# Altium schematic sheet Copy of Power_Board.SchDoc: MAIN POWER 5V / 3V3 / 1V8
size A4; Date: Not used; ApprovedBy: Not used; CheckedBy: Not used; Author: Not used; CompanyName: STMicroelectronics; DrawnBy: Not used; Engineer: Not used; Organization: Not used; Address1: Not used; Address2: Not used; Address3: Not used; Address4: Not used; DocumentNumber: 9; Revision: Not used; SheetNumber: 8; SheetTotal: 9; CurrentTime: Not used; CurrentDate: Not used; Time: Not used; DocumentFullPathAndName: Not used; DocumentName: Not used; ModifiedDate: Not used; ImagePath: Not used; ProjectName: Not used; Application_BuildNumber: Not used
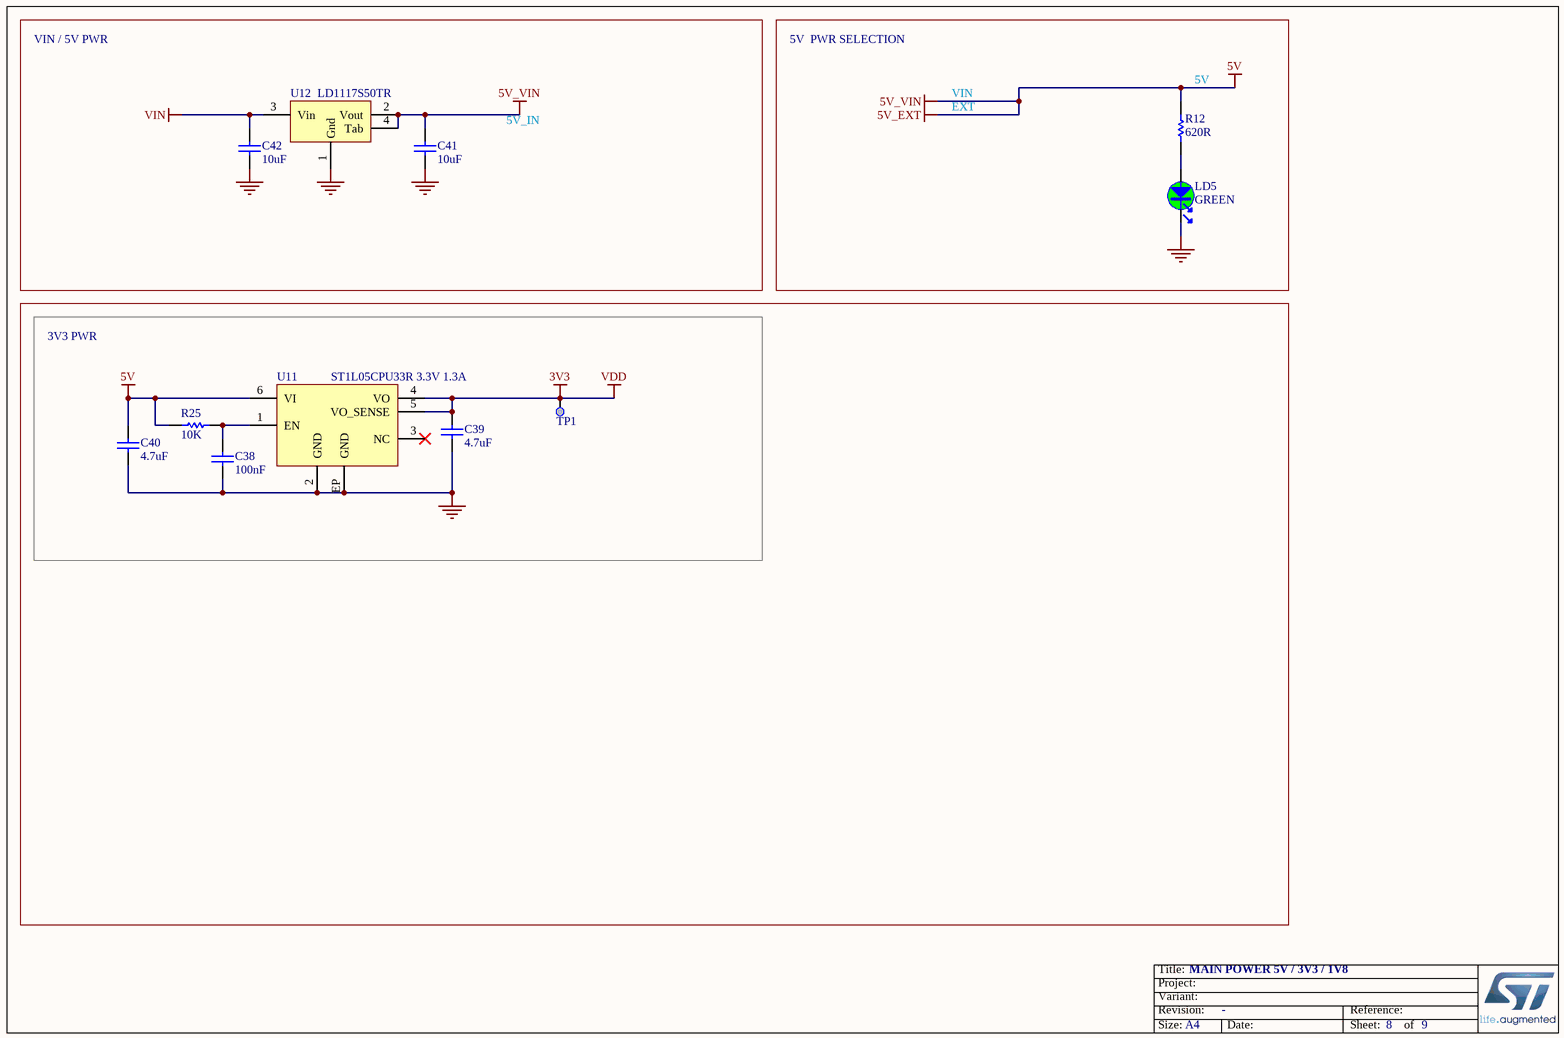
[diagram p0: Copy of Power_Board.SchDoc]

## Parts
C38  value 100nF  [C0402]  (hidden comment: Capacitor)
C39  value 4.7uF  [C0603]  (hidden comment: Capacitor)
C40  value 4.7uF  [C0603]  (hidden comment: Capacitor)
C41  value 10uF  [C0805]  (hidden comment: Capacitor)
C42  value 10uF  [C0805]  (hidden comment: Capacitor)
LD5  value GREEN  [LED_0603_OSRAM_LG-Q396-PS-35_GREEN_1A2K_H0P4]  (hidden comment: LED_green)
R12  value 620R  [R0603]  (hidden comment: Resistor)
R25  value 10K  [R0402]  (hidden comment: Resistor)
TP1  Test Point  [TP_SMD_1MM]  (value not drawn)  (no BOM)
U11  value ST1L05CPU33R 3.3V 1.3A  [ICC_DFN6-EPAD_3X3_P095]  (hidden comment: ST1L05CPU33R)
U12  LD1117S50TR  [REG_SOT223-TAB]

## Blocks framed on the sheet
3V3 PWR: C38-C40 R25 TP1 U11

## Nets
3V3: C39.2 TP1.1 U11.4(VO) U11.5(VO_SENSE)  [also labelled VDD]
5V: C40.2 C41.2 R12.2 R25.2 U11.6(VI) U12.2(Vout) U12.4(Tab)  [also labelled 5V_EXT, 5V_VIN]
GND: C38.2 C39.1 C40.1 C41.1 C42.1 LD5.2 U11.2(GND) U11.EP(GND) U12.1(Gnd)
VIN: C42.2 U12.3(Vin)
NetC38_1: C38.1 R25.1 U11.1(EN)
NetLD5_1: LD5.1 R12.1

Not connected (* = marked no-connect by the designer): U11 3(NC)*

## Notes on the sheet
- VIN / 5V PWR
- 5V  PWR SELECTION
- VIN
- EXT
- (near R12) 5V
- 5V_IN
- Title:
- Project:
- Size:
- Revision:
- Variant:
- A4
- -
- Date:
- Reference:
- Sheet:
- of

## Library data of the parts
C38 = MCD-00006: Capacitor, MLCC, 100nF, 16V, X7R, 10%, 0402, T=0.5mm; Manufacturer_Part_Number: CC0402KRX7R7BB104; Manufacturer: YAGEO; Alternate_Manufacturer_Part_Number: GCM155R71C104KA55D; Alternate_Manufacturer: MURATA; Provided_By: SUBCO; ECCN_US: EAR99; ECCN_EU: NEC; Internal_Part_Number: MCD-00006; ComponentLink1Description: Datasheet; Status: Released; Package: C0402; Part_Type: Capacitor; ComponentLink1URL: http://tunmcdsvn.tun.st.com/Component_Datasheet_Library/Trunk/Capacitors/Yageo_Multilayer_Capacitor_X7R_series_100pF_to_22uF
C39 = MCD-01121: Capacitor, MLCC, 4.7µF, 10V, X5R, 20%, 0603, T=0,8mm; Manufacturer_Part_Number: GRM188R61A475ME15; Manufacturer: MURATA; Provided_By: SUBCO; ECCN_US: EAR99; ECCN_EU: NEC; Internal_Part_Number: MCD-01121; Status: Released; Part_Type: Capacitor; Package: C0603; ComponentLink1Description: Datasheet; ComponentLink1URL: http://tunmcdsvn.tun.st.com/Component_Datasheet_Library/Trunk/Capacitors/Murata_Capacitor_GR_series
C40 = MCD-00097: Capacitor, MLCC, 4.7uF, 16V, X5R, 20%, 0603, T=0,8mm; Manufacturer_Part_Number: GRM188R61C475KE11; Manufacturer: MURATA; Alternate_Manufacturer_Part_Number: GRM188R61C475MAAJ; Provided_By: SUBCO; ECCN_US: EAR99; ECCN_EU: NEC; Internal_Part_Number: MCD-00097; Status: Released; Part_Type: Capacitor; Package: C0603; ComponentLink1Description: Datasheet; ComponentLink1URL: http://tunmcdsvn.tun.st.com/Component_Datasheet_Library/Trunk/Capacitors/Murata_Capacitor_GR_series; Alternate_Manufacturer: Murata
C41 C42 = MCD-00014: Capacitor, MLCC, 10uF, 25V, X5R, 10%, 0805, T=0,85mm; Manufacturer_Part_Number: CC0805KRX5R8BB106; Manufacturer: YAGEO; Provided_By: SUBCO; ECCN_US: EAR99; ECCN_EU: NEC; Internal_Part_Number: MCD-00014; ComponentLink1Description: Datasheet; Status: Released; Part_Type: Capacitor; Package: C0805; ComponentLink1URL: http://tunmcdsvn.tun.st.com/Component_Datasheet_Library/Trunk/Capacitors/Yageo_Multilayer_capacitor_X5R_series_100pF_to_100uF
LD5 = MCD-00588: LED Green, 0603 SMD, Forward Voltage Typ=2V, Max=2.5V; Part_Type: Display; Manufacturer_Part_Number: LG Q396-PS-35; Manufacturer: OSRAM OPTO SEMICONDUCTORS; Alternate_Manufacturer_Part_Number: VLMTG1300-GS08; Alternate_Manufacturer: VISHAY SEMICONDUCTOR OPTO DIVISION; Provided_By: SUBCO; Internal_Part_Number: MCD-00588; Status: Released; Package: LED 0603; ComponentLink1Description: Datasheet; ComponentLink1URL: http://tunmcdsvn.tun.st.com/Component_Datasheet_Library/Trunk/Display/OSRAM_LED_GREEN_LG Q396-PS-35; Order_Code_Digikey: LG Q396-PS-35-ND; ECCN_US: n/a; ECCN_EU: n/a
R12 = MCD-00500: Resistor,620R,0603,1%,1/10W; Manufacturer_Part_Number: RC0603FR-07620RL; Manufacturer: YAGEO; Provided_By: SUBCO; ECCN_US: EAR99; ECCN_EU: NEC; Internal_Part_Number: MCD-00500; Status: Released; Part_Type: Resistor; Package: R0603; ComponentLink1Description: Datasheet; ComponentLink1URL: http://tunmcdsvn.tun.st.com/Component_Datasheet_Library/Trunk/Resistors/Yageo_Resistor_RC0603-series
R25 = MCD-00053: Resistor,10K,0402,1%,1/16W; Manufacturer_Part_Number: RC0402FR-0710KL; Manufacturer: YAGEO; Provided_By: SUBCO; ECCN_US: EAR99; ECCN_EU: NEC; Internal_Part_Number: MCD-00053; Status: Released; ComponentLink1Description: Datasheet; Part_Type: Resistor; Package: R0402; ComponentLink1URL: http://tunmcdsvn.tun.st.com/Component_Datasheet_Library/Trunk/Resistors/Yageo_Resistor_RC0402-series
TP1 = MCD-00074: Test Point 1mm; Part_Type: Mechanical; Internal_Part_Number: MCD-00074; Provided_By: n/a; Status: Released; ComponentLink1Description: Datasheet; ComponentLink1URL: http://na; Manufacturer: n/a; Manufacturer_Part_Number: n/a; ECCN_US: n/a; ECCN_EU: n/a
U11 = MCD-01025: LDO, 3.3V, 1.3A, Very low quiescent current BiCMOS voltage regulator; Part_Type: IC; Manufacturer: STMICROELECTRONICS; BMS_Part_Number: 9176246; Provided_By: SUBCO with ST control; ECCN_US: EAR99; ECCN_EU: NEC; Internal_Part_Number: MCD-01025; Status: Released; Manufacturer_Part_Number: ST1L05CPU33R; Package: DFN6-3x3; ComponentLink1Description: Datasheet; ComponentLink1URL: http://tunmcdsvn.tun.st.com/Component_Datasheet_Library/Trunk/IC/STM_LDO_ST1L05CPU33R
U12 = MCD-00088: IC REG LDO 5V 0.8A SOT223; Manufacturer: STMICROELECTRONICS; BMS_Part_Number: 9176133; Provided_By: SUBCO with ST control; ECCN_US: EAR99; ECCN_EU: NEC; Value: LD1117S50TR; Internal_Part_Number: MCD-00088; Manufacturer_Part_Number: LD1117S50TR; ComponentLink1Description: Datasheet; Status: Released; Part_Type: IC; ComponentLink1URL: http://tunmcdsvn.tun.st.com/Component_Datasheet_Library/Trunk/IC/STM_LDO_LD1117; Package: SOT-223